# Altium schematic sheet Humidity Regulator.SchDoc
size A3
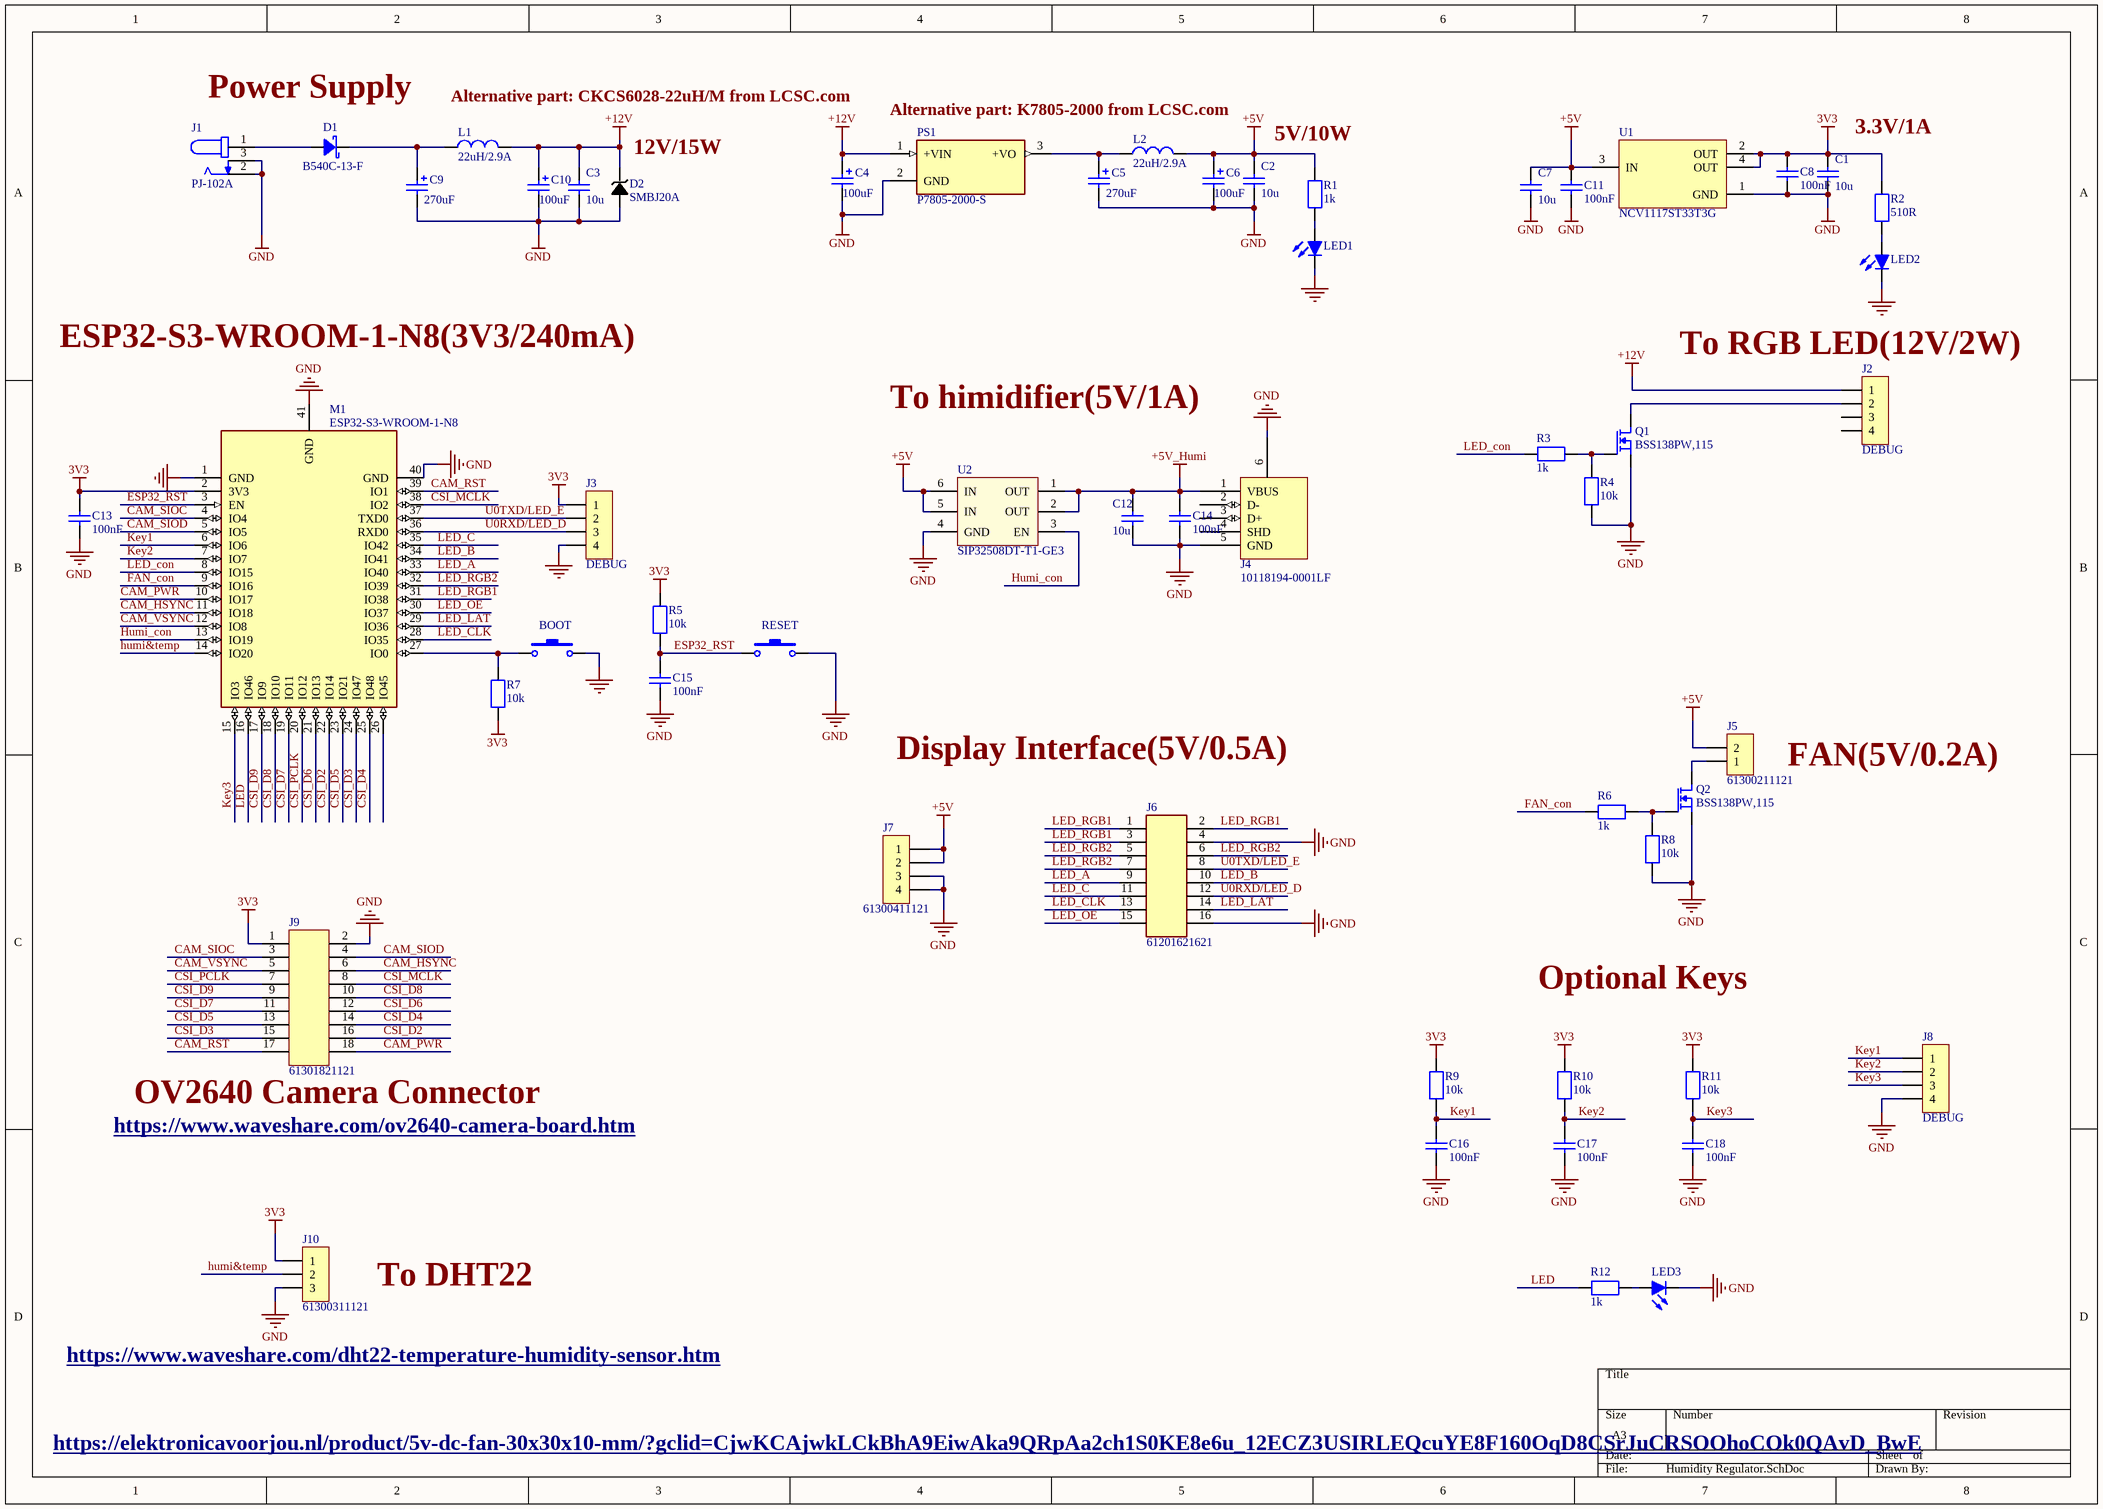
[diagram p0: Humidity Regulator.SchDoc]

## Parts
BOOT  TL3305BF260QG  [SW_TL3305BF260QG]  (value not drawn)
C1  10u  [C1206]
C2  10u  [C1206]
C3  10u  [C1206]
C4  100uF  [CAP_EEUFC1E101S]
C5  270uF  [CAP_EEU-FK1E271B]
C6  100uF  [CAP_EEUFC1E101S]
C7  10u  [C1206]
C8  100nF  [C0603]
C9  270uF  [CAP_EEU-FK1E271B]
C10  100uF  [CAP_EEUFC1E101S]
C11  100nF  [C0603]
C12  10u  [C1206]
C13  100nF  [C0603]
C14  100nF  [C0603]
C15  100nF  [C0603]
C16  100nF  [C0603]
C17  100nF  [C0603]
C18  100nF  [C0603]
D1  B540C-13-F  [DO-214AB2]
D2  SMBJ20A  [DO-214AA2]
J1  PJ-102A  [CUI_PJ-102A]
J2  DEBUG  [61300411121]
J3  DEBUG  [61300411121]
J4  10118194-0001LF  [10118194-0001LF]
J5  61300211121  [61300211121]
J6  61201621621  [61201621621]
J7  61300411121  [61300411121]
J8  DEBUG  [61300411121]
J9  61301821121  [61301821121]
J10  61300311121  [61300311121]
L1  22uH/2.9A  [IND_SRP6030]
L2  22uH/2.9A  [IND_SRP6030]
LED1  SML-D12U1WT86  [LED0603]  (value not drawn)
LED2  SML-D12U1WT86  [LED0603]  (value not drawn)
LED3  SML-D12U1WT86  [LED0603]  (value not drawn)
M1  ESP32-S3-WROOM-1-N8  [ESP32-S3-WROOM-1-N8]
PS1  P7805-2000-S  [CONV_P7805-2000-S]
Q1  BSS138PW,115  [SOT323-3]
Q2  BSS138PW,115  [SOT323-3]
R1  1k  [R0603]
R2  510R  [R0603]
R3  1k  [R0603]
R4  10k  [R0603]
R5  10k  [R0603]
R6  1k  [R0603]
R7  10k  [R0603]
R8  10k  [R0603]
R9  10k  [R0603]
R10  10k  [R0603]
R11  10k  [R0603]
R12  1k  [R0603]
RESET  TL3305BF260QG  [SW_TL3305BF260QG]  (value not drawn)
U1  NCV1117ST33T3G  [SOT223-3]
U2  SIP32508DT-T1-GE3  [TSOT23-6]

## Nets
3V3: C1.2 C8.2 C13.2 J3.1 J9.1 J10.1 M1.2(3V3) R2.2 R5.2 R7.2 R9.2 R10.2 R11.2 U1.2(OUT) U1.4(OUT)
+5V: C2.2 C6.1 C7.2 C11.2 J5.2 J7.1 J7.2 L2.2 R1.2 U1.3(IN) U2.5(IN) U2.6(IN)
+5V_Humi: C12.2 C14.2 J4.1(VBUS) U2.1(OUT) U2.2(OUT)
+12V: C3.2 C4.1 C10.1 D2.C J2.1 L1.2 PS1.1(+VIN)
GND: BOOT.2 C1.1 C2.1 C3.1 C4.2 C5.2 C6.2 C7.1 C8.1 C9.2 C10.2 C11.1 C12.1 C13.1 C14.1 C15.1 C16.1 C17.1 C18.1 D2.A J1.2 J1.3 J3.4 J4.5(GND) J4.6 J6.4 J6.16 J7.3 J7.4 J8.4 J9.2 J10.3 LED1.C LED2.C LED3.C M1.1(GND) M1.40(GND) M1.41(GND) PS1.2(GND) Q1.2(S) Q2.2(S) R4.1 R8.1 RESET.2 U1.1(GND) U2.4(GND)
CAM_HSYNC: J9.6 M1.11(IO18)
CAM_PWR: J9.18 M1.10(IO17)
CAM_RST: J9.17 M1.39(IO1)
CAM_SIOC: J9.3 M1.4(IO4)
CAM_SIOD: J9.4 M1.5(IO5)
CAM_VSYNC: J9.5 M1.12(IO8)
CSI_D2: J9.16 M1.22(IO14)
CSI_D3: J9.15 M1.24(IO47)
CSI_D4: J9.14 M1.25(IO48)
CSI_D5: J9.13 M1.23(IO21)
CSI_D6: J9.12 M1.21(IO13)
CSI_D7: J9.11 M1.19(IO11)
CSI_D8: J9.10 M1.18(IO10)
CSI_D9: J9.9 M1.17(IO9)
CSI_MCLK: J9.8 M1.38(IO2)
CSI_PCLK: J9.7 M1.20(IO12)
ESP32_RST: C15.2 M1.3(EN) R5.1 RESET.1
FAN_con: M1.9(IO16) R6.1
humi&temp: J10.2 M1.14(IO20)
Humi_con: M1.13(IO19) U2.3(EN)
Key1: C16.2 J8.1 M1.6(IO6) R9.1
Key2: C17.2 J8.2 M1.7(IO7) R10.1
Key3: C18.2 J8.3 M1.15(IO3) R11.1
LED: M1.16(IO46) R12.2
LED_A: J6.9 M1.33(IO40)
LED_B: J6.10 M1.34(IO41)
LED_C: J6.11 M1.35(IO42)
LED_CLK: J6.13 M1.28(IO35)
LED_con: M1.8(IO15) R3.1
LED_LAT: J6.14 M1.29(IO36)
LED_OE: J6.15 M1.30(IO37)
LED_RGB1: J6.1 J6.2 J6.3 M1.31(IO38)
LED_RGB2: J6.5 J6.6 J6.7 M1.32(IO39)
U0RXD/LED_D: J3.3 J6.12 M1.36(RXD0)
U0TXD/LED_E: J3.2 J6.8 M1.37(TXD0)
NetBOOT_1: BOOT.1 M1.27(IO0) R7.1
NetC5_1: C5.1 L2.1 PS1.3(+VO)
NetC9_1: C9.1 D1.C L1.1
NetD1_A: D1.A J1.1
NetJ2_2: J2.2 Q1.3(D)
NetJ5_1: J5.1 Q2.3(D)
NetLED1_A: LED1.A R1.1
NetLED2_A: LED2.A R2.1
NetLED3_A: LED3.A R12.1
NetQ1_1: Q1.1(G) R3.2 R4.2
NetQ2_1: Q2.1(G) R6.2 R8.2

Not connected (* = marked no-connect by the designer): J2 3 4; J4 2(D-) 3(D+) 4(SHD); M1 26(IO45)

## Notes on the sheet
- Power Supply
- (near L1) Alternative part: CKCS6028-22uH/M from LCSC.com
- (near D2) 12V/15W
- Alternative part: K7805-2000 from LCSC.com
- 5V/10W
- 3.3V/1A
- ESP32-S3-WROOM-1-N8(3V3/240mA)
- (near J2) To RGB LED(12V/2W)
- To himidifier(5V/1A)
- Display Interface(5V/0.5A)
- FAN(5V/0.2A)
- Optional Keys
- (near J9) OV2640 Camera Connector
- https://www.waveshare.com/ov2640-camera-board.htm
- To DHT22
- https://www.waveshare.com/dht22-temperature-humidity-sensor.htm
- https://elektronicavoorjou.nl/product/5v-dc-fan-30x30x10-mm/?gclid=CjwKCAjwkLCkBhA9EiwAka9QRpAa2ch1S0KE8e6u_12ECZ3USIRLEQcuYE8F160OqD8CSrJuCRSOOhoCOk0QAvD_BwE

## Library data of the parts
BOOT RESET = TL3305BF260QG: SWITCH TACTILE SPST-NO 0.05A 12V; Manufacturer: E-Switch; Value: TL3305BF260QG; Manufacturer Part Number: TL3305BF260QG; Supplier: Mouser; Supplier Part Number: 612-TL3305BF260QG; Price: 0.25
C1-C3 C7 C12 = 10uF ± 10% 25V: Manufacturer: Yageo; Manufacturer Part Number: CC1206KKX7R8BB106; Tolerance: +-10%; Type: X7R; Voltage (V): 25; Category: Capacitor; Value: 10u; Price: 0.44; Supplier: Mouser; Supplier Part Number: 603-CC126KKX7R8BB106
C4 C6 C10 = EEU-FC1E101S: CAP ALUM 100UF 20% 25V SMD; Manufacturer: Panasonic; Manufacturer Part Number: EEU-FC1E101S; Value: 100uF; Supplier: Mouser; Supplier Part Number: 667-EEU-FC1E101S; Price: 0.4
C5 C9 = EEU-FC1E271B: CAP ALUM 270UF 20% 25V SMD; Manufacturer: Panasonic; Manufacturer Part Number: EEU-FC1E271B; Value: 270uF; Supplier: Mouser; Supplier Part Number: 667-EEU-FC1E271B; Price: 0.7
C8 C11 C13-C18 = 100nF ± 10% 50V: Manufacturer: Yageo; Manufacturer Part Number: CC0603KRX7R9BB104; Value: 100nF; Supplier: Mouser; Supplier Part Number: 603-CC603KRX7R9BB104; Price: 0.1
D1 = B540C-13-F: Schottky Diodes & Rectifiers 40V 5A; Value: B540C-13-F; Manufacturer Part Number: B540C-13-F; Manufacturer: Diodes; Supplier: Mouser; Supplier Part Number: 621-B540C-F; Price: 0.5
D2 = ZM4746A-GS08: ESD Suppressors / TVS Diodes 600W, 23.4V, 5%, Unidirectional, TVS; Manufacturer: Littelfuse; Value: SMBJ20A; Manufacturer Part Number: SMBJ20A; Supplier: Mouser; Supplier Part Number: 576-SMBJ20A; Price: 0.35
J1 = PJ-102A: CONN PWR JACK 2X5.5MM SOLDER; Manufacturer: CUI Devices; Manufacturer Part Number: PJ-102A; Value: PJ-102A; Supplier: Mouser; Supplier Part Number: 490-PJ-102A; Price: 0.8
J2 J3 J7 J8 = 61300411121: Headers & Wire Housings WR-PHD 2.54mm Hdr 4P Single Gold; Manufacturer: Mouser; Manufacturer Part Number: 61300411121; Price: 0.5; Supplier: Mouser; Supplier Part Number: 710-61300411121; Value: 61300411121
J4 = 10118194-0001LF: CONN RCPT USB2.0 MICRO B SMD R/A; Manufacturer: Amphenol FCI; Gender: Receptacle; Current Rating: 1.8A; Connector Type: USB,Receptacle; Number of Contacts: 5; Insulation Resistance: 1GR; Number of Ports: 1; Max Voltage Rating (AC): 100V; Pitch: 0.65mm; Supplier: Mouser; Supplier Part Number: 649-10118194-0001LF; Manufacturer Part Number: 10118194-0001LF; Stock 1: 145984; Price: 0.5; Mount: Surface Mount,Horizontal; Contact Material: Copper Alloy; Contact Plating: Gold; Number of Terminals: 5; Housing Material: Polymer; Color: Black; Min Operating Temperature: -55°C; Max Operating Temperature: 85°C; Package Quantity: 9600; Packaging: Tape and Reel; Termination: Solder; Orientation: Right Angle; Features: Shielded; Length: 8.05mm; Depth: 5mm; Radiation Hardening: No; Lead Free: Lead Free; Flammability Rating: UL94 V-0; ComponentLink1URL: http://www.amphenol-icc.com/media/wysiwyg/files/drawing/10118194.pdf?src-supplier=Digi-Key; ComponentLink1Description: http://www.amphenol-icc.com/media/wysiwyg/files/drawing/10118194.pdf?src-supplier=Digi-Key; ComponentLink2URL: https://cdn.amphenol-icc.com/media/wysiwyg/files/drawing/10118194.pdf?src-supplier=Mouser; ComponentLink2Description: https://cdn.amphenol-icc.com/media/wysiwyg/files/drawing/10118194.pdf?src-supplier=Mouser; ComponentLink3URL: https://cdn.amphenol-icc.com/media/wysiwyg/files/drawing/10118194.pdf?src-supplier=Avnet; ComponentLink3Description: https://cdn.amphenol-icc.com/media/wysiwyg/files/drawing/10118194.pdf?src-supplier=Avnet; ComponentLink4URL: https://cdn.amphenol-icc.com/media/wysiwyg/files/drawing/10118194.pdf?src-supplier=Verical; ComponentLink4Description: https://cdn.amphenol-icc.com/media/wysiwyg/files/drawing/10118194.pdf?src-supplier=Verical
J5 = 61300211121: Headers & Wire Housings WR-PHD 2.54mm Hdr 2P Single Gold; Manufacturer: Mouser; Manufacturer Part Number: 61300211121; Price: 0.5; Supplier: Mouser; Supplier Part Number: 710-61300211121; Value: 61300211121
J6 = 61201621621: Connector Header Through Hole 16 position 0.100 (2.54mm); Manufacturer: Wurth Electronics; Manufacturer Part Number: 61201621621; Supplier Part Number: 710-61201621621; Price: 0.6; Supplier: Mouser; Value: 61201621621
J9 = 61301821121: Headers & Wire Housings WR-PHD 2.54mm Hdr 18 P Dual Str Gold; Manufacturer: Wurth Electronics; Supplier: Mouser; Price: 1.2; Supplier Part Number: 710-61301821121; Value: 61301821121; Manufacturer Part Number: 61301821121
J10 = 61300311121: Headers & Wire Housings WR-PHD 2.54mm Hdr 3P Single Gold; Manufacturer: Mouser; Manufacturer Part Number: 61300311121; Price: 0.5; Supplier: Mouser; Supplier Part Number: 710-61300311121; Value: 61300311121
L1 L2 = SRP6030WA-220M: Power Inductors - SMD Ind,7.1x6.6x2.8mm,22uH+/-20%,2.9A,shd; Manufacturer: Bourns; Manufacturer Part Number: SRP6030WA-220M; Value: 22uH/2.9A; Supplier: Mouser; Supplier Part Number: 652-SRP6030WA-220M; Price: 1.2
LED1-LED3 = SML-D12U1WT86: Typical RED GaAs LED; Manufacturer: Rohm Semiconductor; Supplier: Mouser; Supplier Part Number: 755-SML-D12U1WT86; Manufacturer Part Number: SML-D12U1WT86; Value: SML-D12U1WT86; Price: 0.2
M1 = ESP32-S3-WROOM-1-N8: Bluetooth, WiFi 802.11b/g/n, Bluetooth v5.0 Transceiver Module 2.4GHz PCB Trace Surface Mount; Manufacturer: Espressif Systems; Price: 3.45; Value: ESP32-S3-WROOM-1-N8; Supplier Part Number: 356-ESP32-S3WROOM1N8; Manufacturer Part Number: ESP32-S3-WROOM-1-N8; Supplier: Mouser
PS1 = P7805-2000-S: 2 A Output Current, 6~36 Vdc Input, SIP, Non-Isolated, Dc-Dc Converter; Manufacturer: CUI Inc.; Price: 6.5; Supplier: Mouser; Value: P7805-2000-S; Supplier Part Number: 490-P7805-2000-S; Manufacturer Part Number: P7805-2000-S
Q1 Q2 = BSS138PW,115: MOSFET, N CH, 60V, 0.2A; Manufacturer: Nexperia; Value: BSS138PW,115; Manufacturer Part Number: BSS138PW,115; Supplier: Mouser; Supplier Part Number: 771-BSS138PW115; Price: 0.3
R1 R3 R6 R12 = 1 kOhms ±1% 0.1W: Manufacturer: Yageo; Manufacturer Part Number: RC0603FR-071KL; Value: 1k; Supplier: Mouser; Supplier Part Number: 603-RC0603FR-071KL; Price: 0.1
R2 = 510 Ohm ±1% 0.1W: Manufacturer: Yageo; Manufacturer Part Number: RC0603FR-07510RL; Value: 510R; Supplier: Mouser; Supplier Part Number: 603-RC0603FR-07510RL; Price: 0.1
R4 R5 R7-R11 = 10 kOhms ±1% 0.1W: Manufacturer: Yageo; Manufacturer Part Number: RC0603FR-0710KL; Value: 10k; Supplier: Mouser; Supplier Part Number: 603-RC0603FR-0710KL; Price: 0.1
U1 = NCV1117ST33T3G: LDO Voltage Regulators 3.3V 1.0A Automotive; Manufacturer: onsemi; Price: 0.7; Manufacturer Part Number: NCV1117ST33T3G; Supplier Part Number: 863-NCV1117ST33T3G; Value: NCV1117ST33T3G; Supplier: Mouser
U2 = SIP32508DT-T1-GE3: Power Switch ICs - Power Distribution Slew Rate Controlled Load Switch; Manufacturer: Vishay / Siliconix; Value: SIP32508DT-T1-GE3; Supplier Part Number: 78-SIP32508DT-T1-GE3; Supplier: Mouser; Price: 0.6; Manufacturer Part Number: SIP32508DT-T1-GE3